# Altium schematic sheet Misc. Connections.SchDoc
size Letter; SheetNumber: 13; SheetTotal: 14
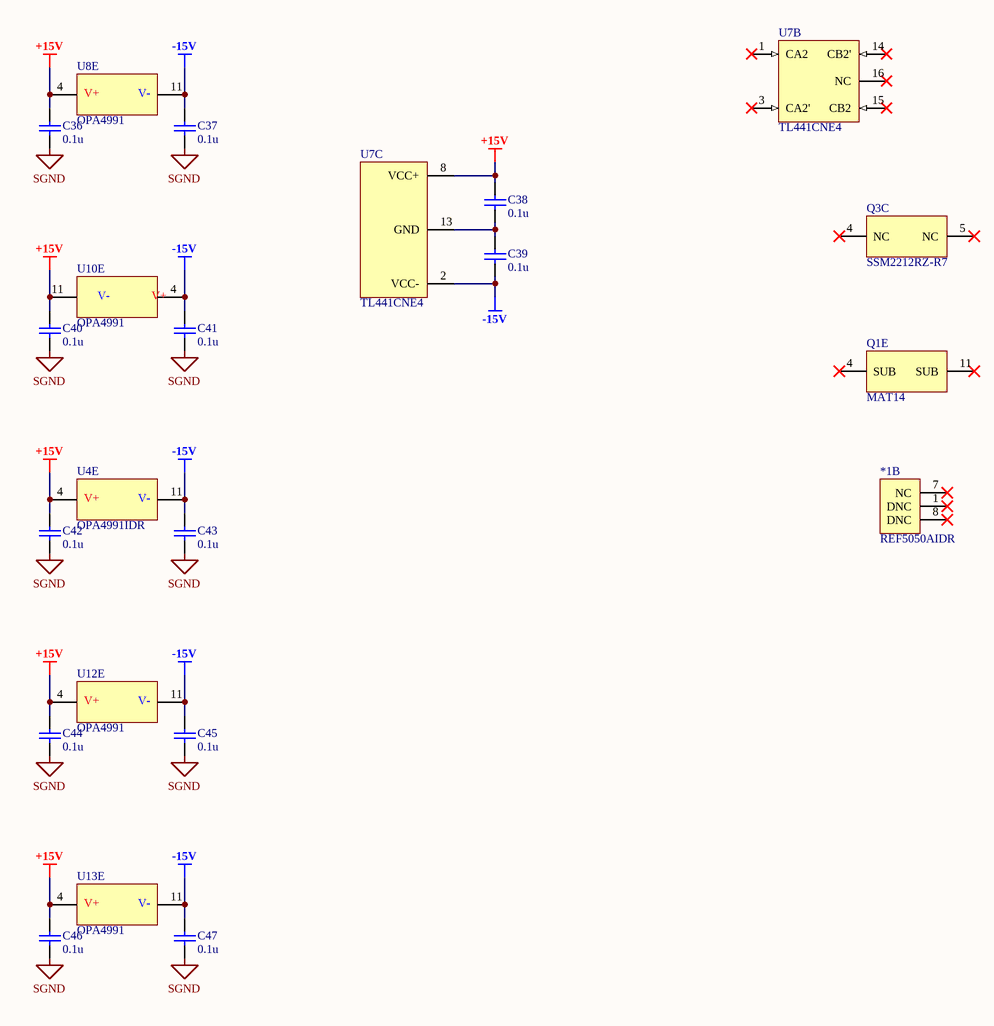
[diagram p0: Misc. Connections.SchDoc]

## Parts
*1  REF5050AIDR  [D0008A_M]  (part B of 2)
C36  value 0.1u  (hidden comment: Capacitor)
C37  value 0.1u  (hidden comment: Capacitor)
C38  value 0.1u  (hidden comment: Capacitor)
C39  value 0.1u  (hidden comment: Capacitor)
C40  value 0.1u  (hidden comment: Capacitor)
C41  value 0.1u  (hidden comment: Capacitor)
C42  value 0.1u  (hidden comment: Capacitor)
C43  value 0.1u  (hidden comment: Capacitor)
C44  value 0.1u  (hidden comment: Capacitor)
C45  value 0.1u  (hidden comment: Capacitor)
C46  value 0.1u  (hidden comment: Capacitor)
C47  value 0.1u  (hidden comment: Capacitor)
Q1  MAT14  [FP-R-14-IPC_B]  (part E of 5)
Q3  SSM2212RZ-R7  [FP-R-8-IPC_B]  (part C of 3)
U4  OPA4991IDR  [FP-D0014A-IPC_B]  (part E of 5)
U7  TL441CNE4  [TI-N16]  (parts B,C of 3)
U8  OPA4991  [FP-D0014A-IPC_B]  (part E of 5)
U10  OPA4991  [FP-D0014A-IPC_B]  (part E of 5)
U12  OPA4991  [FP-D0014A-IPC_B]  (part E of 5)
U13  OPA4991  [FP-D0014A-IPC_B]  (part E of 5)

## Nets
+15V: C36.2 C38.2 C40.2 C42.2 C44.2 C46.2 U4.4(V+) U7.8(VCC+) U8.4(V+) U10.11(V-) U12.4(V+) U13.4(V+)
-15V: C37.2 C39.1 C41.2 C43.2 C45.2 C47.2 U4.11(V-) U7.2(VCC-) U8.11(V-) U10.4(V+) U12.11(V-) U13.11(V-)
SGND: C36.1 C37.1 C40.1 C41.1 C42.1 C43.1 C44.1 C45.1 C46.1 C47.1
NetC38_1: C38.1 C39.2 U7.13(GND)

Not connected (* = marked no-connect by the designer): *1 1(DNC)* 7(NC)* 8(DNC)*; Q1 4(SUB)* 11(SUB)*; Q3 4(NC)* 5(NC)*; U7 1(CA2)* 3(CA2')* 14(CB2')* 15(CB2)* 16(NC)*

## Library data of the parts
*1 = REF5050AIDR: Three Terminal Voltage Reference, 1 Output, 5V, Trim/Adjustable, PDSO8; Manufacturer: Texas Instruments; Package Body Material: Plastic; Channels: 1; Package Equivalence Code: SOP8,.25; Max Supply Voltage: 18V; Min Supply Voltage: 2.7V; Temp Coef of Voltage-Max: 3ppm/°C; Trim/Adjustable Output: Yes; Voltage Tolerance-Max: 0.1%; Max Output Voltage: 5.005V; Min Output Voltage: 4.995V; Qualification Status: Not Qualified; Supplier: Mouser; Supplier Part Number: 595-REF5050AIDR; Manufacturer Part Number: REF5050AIDR; RoHS: Yes; Category: Voltage References; Stock: 15005; Pricing: 1=3.52, 10=3.17, 50=3.17, 100=2.59, 250=2.46, 500=2.21, 1000=1.86, 2500=1.77, 5000=1.7, 10000=1.77 (USD); Case/Package: SOP; Pins: 8; Package Shape: Rectangular; Terminal Finish: Nickel; Min Operating Temperature: -40°C; Max Operating Temperature: 125°C; JESD-609 Code: e4; Throw Configuration: THREE TERMINAL VOLTAGE REFERENCE; JESD-30 Code: R-PDSO-G8; Moisture Sensitivity Level: 2; Number of Outputs: 1; Nominal Output Voltage: 5V; Package Style: SMALL OUTLINEMeter; Peak Reflow Temperature (Cel): 260°C; Surface Mount: Yes; Terminal Form: Gull Wing; Terminal Position: DUAL; Length: 4.9mm; Width: 3.9mm; Height - Seated (Max): 1.75mm; Terminal Pitch: 1.27mm; Temperature Grade: AUTOMOTIVE; Reach SVHC Compliant: Yes; RoHS Compliant: Yes; ComponentLink1URL: https://www.ti.com:443/lit/ds/symlink/ref5010.pdf?src-supplier=IHS+Markit; ComponentLink1Description: https://www.ti.com:443/lit/ds/symlink/ref5010.pdf?src-supplier=IHS+Markit; ComponentLink2URL: https://datasheet.ciiva.com/3236/ref5050-3236312.pdf?src-supplier=Avnet; ComponentLink2Description: https://datasheet.ciiva.com/3236/ref5050-3236312.pdf?src-supplier=Avnet; ComponentLink3URL: https://datasheet.ciiva.com/2012/ref5020-2012761.pdf?src-supplier=Digikey; ComponentLink3Description: https://datasheet.ciiva.com/2012/ref5020-2012761.pdf?src-supplier=Digikey
C36-C47 = Capacitor: SimulationGenericComponent: True
Q1 = MAT14ARZ: TRANS 4NPN 40V 0.03A 14SO; Transition Frequency: 300MHz; Max Collector Current: 30mA; Max Frequency: 1kHz; Collector-emitter Voltage-Max: 60mV; Number of Elements: 4; Polarity: NPN; Max Operating Temperature: 85°C; Collector Emitter Voltage (VCEO): 40V; Collector Emitter Breakdown Voltage: 40V; REACH SVHC: No SVHC; Series: MAT14; Collector Base Voltage (VCBO): 40V; Mount: Surface Mount; Packaging: Rail/Tube; Package Quantity: 56; Case/Package: SOIC; Min Operating Temperature: -40°C; Length: 8.75mm; RoHS Compliant: Yes; Frequency: 300MHz; Radiation Hardening: No; Lead Free: Contains Lead; Collector Emitter Saturation Voltage: 60mV; Height: 1.5mm; Width: 4mm; Number of Pins: 14
Q3 = SSM2212: TRANS 2NPN 40V 0.02A 8SOIC; Transition Frequency: 450MHz; Max Power Dissipation: 500mW; Element Configuration: Dual; Max Collector Current: 20mA; Polarity: NPN; Collector Emitter Breakdown Voltage: 45V; Number of Elements: 2; Collector-emitter Voltage-Max: 800mV; Frequency: 200MHz; Packaging: Tape and Reel; RoHS Compliant: Yes; Lead Free: Contains Lead; Contact Plating: Tin; Collector Emitter Voltage (VCEO): 40V; Max Breakdown Voltage: 40V; Case/Package: SOIC; Series: SSM2212; Radiation Hardening: No; Package Quantity: 1000; Number of Pins: 8; Collector Base Voltage (VCBO): 40V; Mount: Surface Mount; Max Operating Temperature: 85°C; Min Operating Temperature: -40°C
U4 U8 U10 U12 U13 = OPA4991IDR: 40-V, DUAL 4.5MHZ, RAIL-TO-RAIL
U7 = TL441CNE4: Logarithmic Amplifier, 0 to 70 degC, 16-pin DIP (N16), Pb-Free (RoHS); Manufacturer: Texas Instruments; Iq(Max)(mA): 23; DatasheetVersion: SLVS328; ComponentLink3URL: http://www.ti.com/litv/pdf/mpdi002c; Eco-Plan: Pb-Free (RoHS); ComponentLink2URL: http://www.ti.com/general/docs/lit/getliterature.tsp?genericPartNumber=TL441&fileType=pdf; SubFamily: Logarithmic Amplifier; ComponentLink3Description: Package Specification; ComponentLink1Description: Manufacturer URL; ComponentLink1URL: http://www.ti.com/; PackageDescription: 16-Pin Plastic In-Line, Body 19.305 x 6.35 mm, Pitch 2.54 mm; PackageVersion: 4040049/E, 12/2002; Code_JEDEC: MS-001; PartNumber: TL441CNE4; ComponentLink2Description: Datasheet; PackageReference: N16; Mounting Technology: Through Hole